# Altium project PCB_Project.PrjPcb
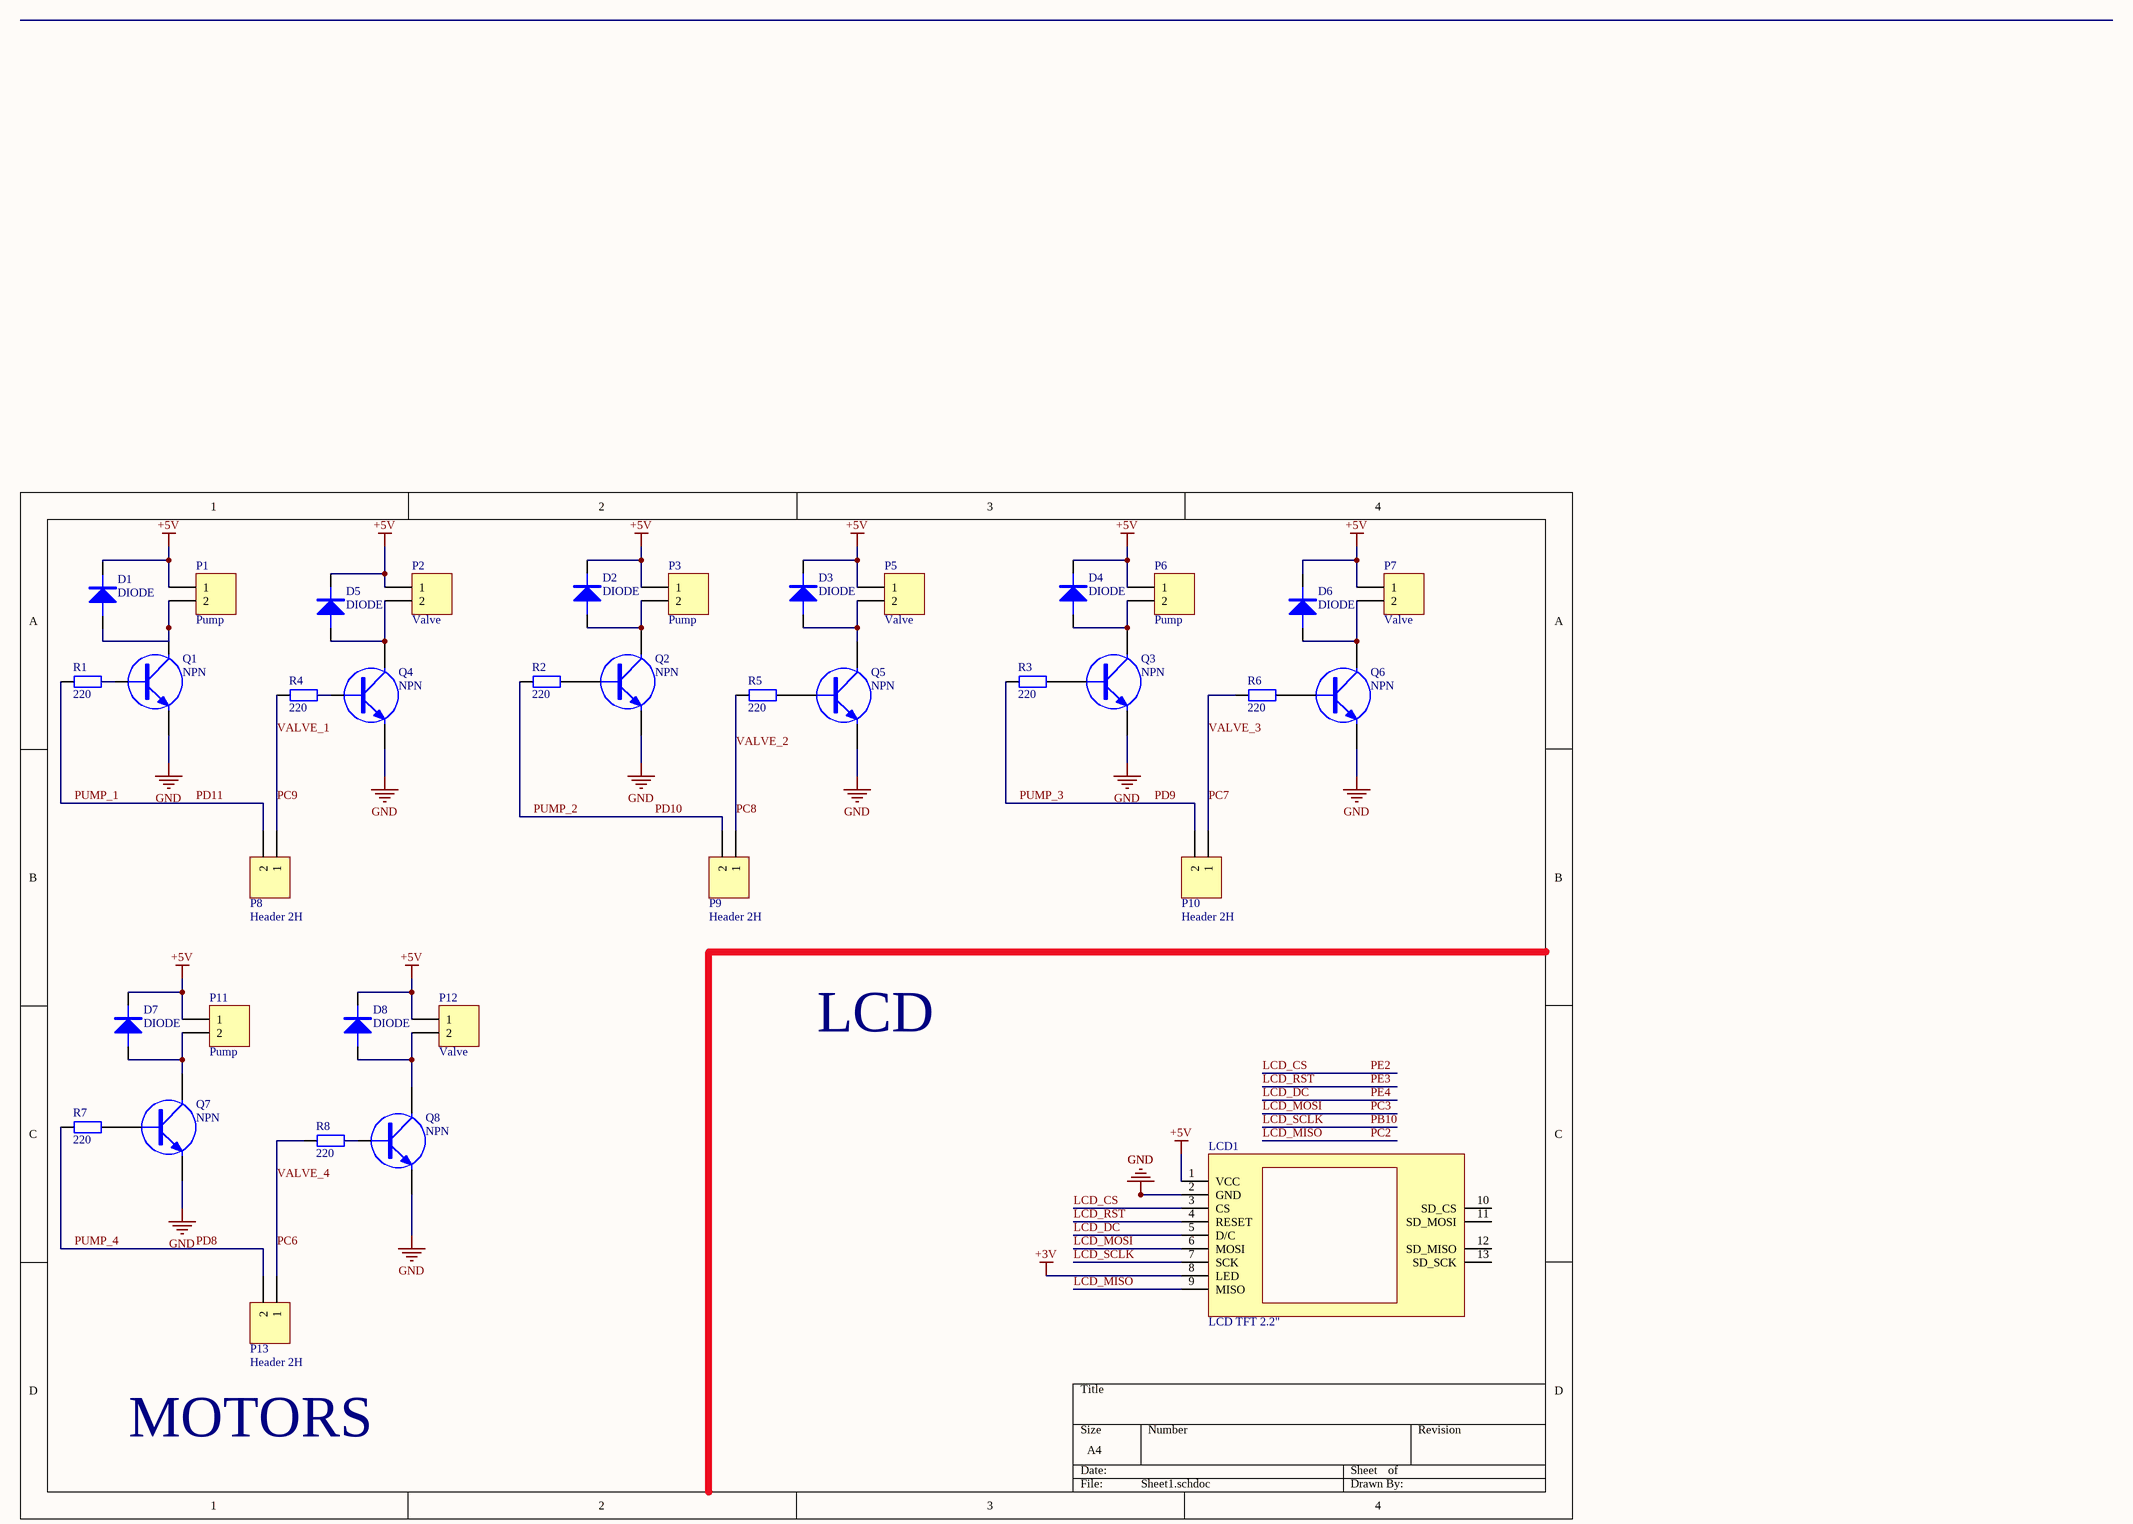
[diagram p0: Sheet1.schdoc]
3 sheets, 216 parts. Net scope: global (net labels, ports and power ports of the same name join across sheets).
Board files: PCB1.PcbDoc, PCB2.PcbDoc
Sheets:
  Sheet1.schdoc
  Sheet2.SchDoc
  Sheet3.SchDoc

## Sheet Sheet1.schdoc
size A4

### Parts
D1  DIODE  [DIODE SMA]
D2  DIODE  [DIODE SMA]
D3  DIODE  [DIODE SMA]
D4  DIODE  [DIODE SMA]
D5  DIODE  [DIODE SMA]
D6  DIODE  [DIODE SMA]
D7  DIODE  [DIODE SMA]
D8  DIODE  [DIODE SMA]
LCD1  LCD TFT 2.2"  [LCD TFT 2.2"]
P1  Pump  [HDR1X2]
P2  Valve  [HDR1X2]
P3  Pump  [HDR1X2]
P5  Valve  [HDR1X2]
P6  Pump  [HDR1X2]
P7  Valve  [HDR1X2]
P8  Header 2H  [HDR1X2]
P9  Header 2H  [HDR1X2]
P10  Header 2H  [HDR1X2]
P11  Pump  [HDR1X2]
P12  Valve  [HDR1X2]
P13  Header 2H  [HDR1X2]
Q1  NPN  [SOT23 - 3PIN]
Q2  NPN  [SOT23 - 3PIN]
Q3  NPN  [SOT23 - 3PIN]
Q4  NPN  [SOT23 - 3PIN]
Q5  NPN  [SOT23 - 3PIN]
Q6  NPN  [SOT23 - 3PIN]
Q7  NPN  [SOT23 - 3PIN]
Q8  NPN  [SOT23 - 3PIN]
R1  220  [0805 RESISTOR]
R2  220  [0805 RESISTOR]
R3  220  [0805 RESISTOR]
R4  220  [0805 RESISTOR]
R5  220  [0805 RESISTOR]
R6  220  [0805 RESISTOR]
R7  220  [0805 RESISTOR]
R8  220  [0805 RESISTOR]

### Nets
+3V: LCD1.8(LED)
+5V: D1.2 D2.2 D3.2 D4.2 D5.2 D6.2 D7.2 D8.2 LCD1.1(VCC) P1.1 P2.1 P3.1 P5.1 P6.1 P7.1 P11.1 P12.1
GND: LCD1.2(GND) Q1.1(E) Q2.1(E) Q3.1(E) Q4.1(E) Q5.1(E) Q6.1(E) Q7.1(E) Q8.1(E)
LCD_CS: LCD1.3(CS)  [also labelled PE2]
LCD_DC: LCD1.5(D/C)  [also labelled PE4]
LCD_MISO: LCD1.9(MISO)  [also labelled PC2]
LCD_MOSI: LCD1.6(MOSI)  [also labelled PC3]
LCD_RST: LCD1.4(RESET)  [also labelled PE3]
LCD_SCLK: LCD1.7(SCK)  [also labelled PB10]
PC6: P13.1 R8.2  [also labelled VALVE_4]
PC7: P10.1 R6.2  [also labelled VALVE_3]
PC8: P9.1 R5.2  [also labelled VALVE_2]
PC9: P8.1 R4.2  [also labelled VALVE_1]
PD8: P13.2 R7.2  [also labelled PUMP_4]
PD9: P10.2 R3.2  [also labelled PUMP_3]
PD10: P9.2 R2.2  [also labelled PUMP_2]
PD11: P8.2 R1.2  [also labelled PUMP_1]
NetD1_1: D1.1 P1.2 Q1.2(C)
NetD2_1: D2.1 P3.2 Q2.2(C)
NetD3_1: D3.1 P5.2 Q5.2(C)
NetD4_1: D4.1 P6.2 Q3.2(C)
NetD5_1: D5.1 P2.2 Q4.2(C)
NetD6_1: D6.1 P7.2 Q6.2(C)
NetD7_1: D7.1 P11.2 Q7.2(C)
NetD8_1: D8.1 P12.2 Q8.2(C)
NetQ1_3: Q1.3(B) R1.1
NetQ2_3: Q2.3(B) R2.1
NetQ3_3: Q3.3(B) R3.1
NetQ4_3: Q4.3(B) R4.1
NetQ5_3: Q5.3(B) R5.1
NetQ6_3: Q6.3(B) R6.1
NetQ7_3: Q7.3(B) R7.1
NetQ8_3: Q8.3(B) R8.1

Not connected (* = marked no-connect by the designer): LCD1 10(SD_CS) 11(SD_MOSI) 12(SD_MISO) 13(SD_SCK)

### Notes on the sheet
- LCD
- MOTORS

### Library data of the parts
P1-P3 P5-P7 P11 P12 = Header 2H: LatestRevisionDate: 17-Jul-2002; LatestRevisionNote: Re-released for DXP Platform.; Publisher: Altium Limited
R1-R8 = RESISTOR: Value: R1/4W - 1K
P8-P10 P13 = Header 2H: LatestRevisionDate: 17-Jul-2002; LatestRevisionNote: Re-released for DXP Platform.; Publisher: Altium Limited

## Sheet Sheet2.SchDoc
size A3
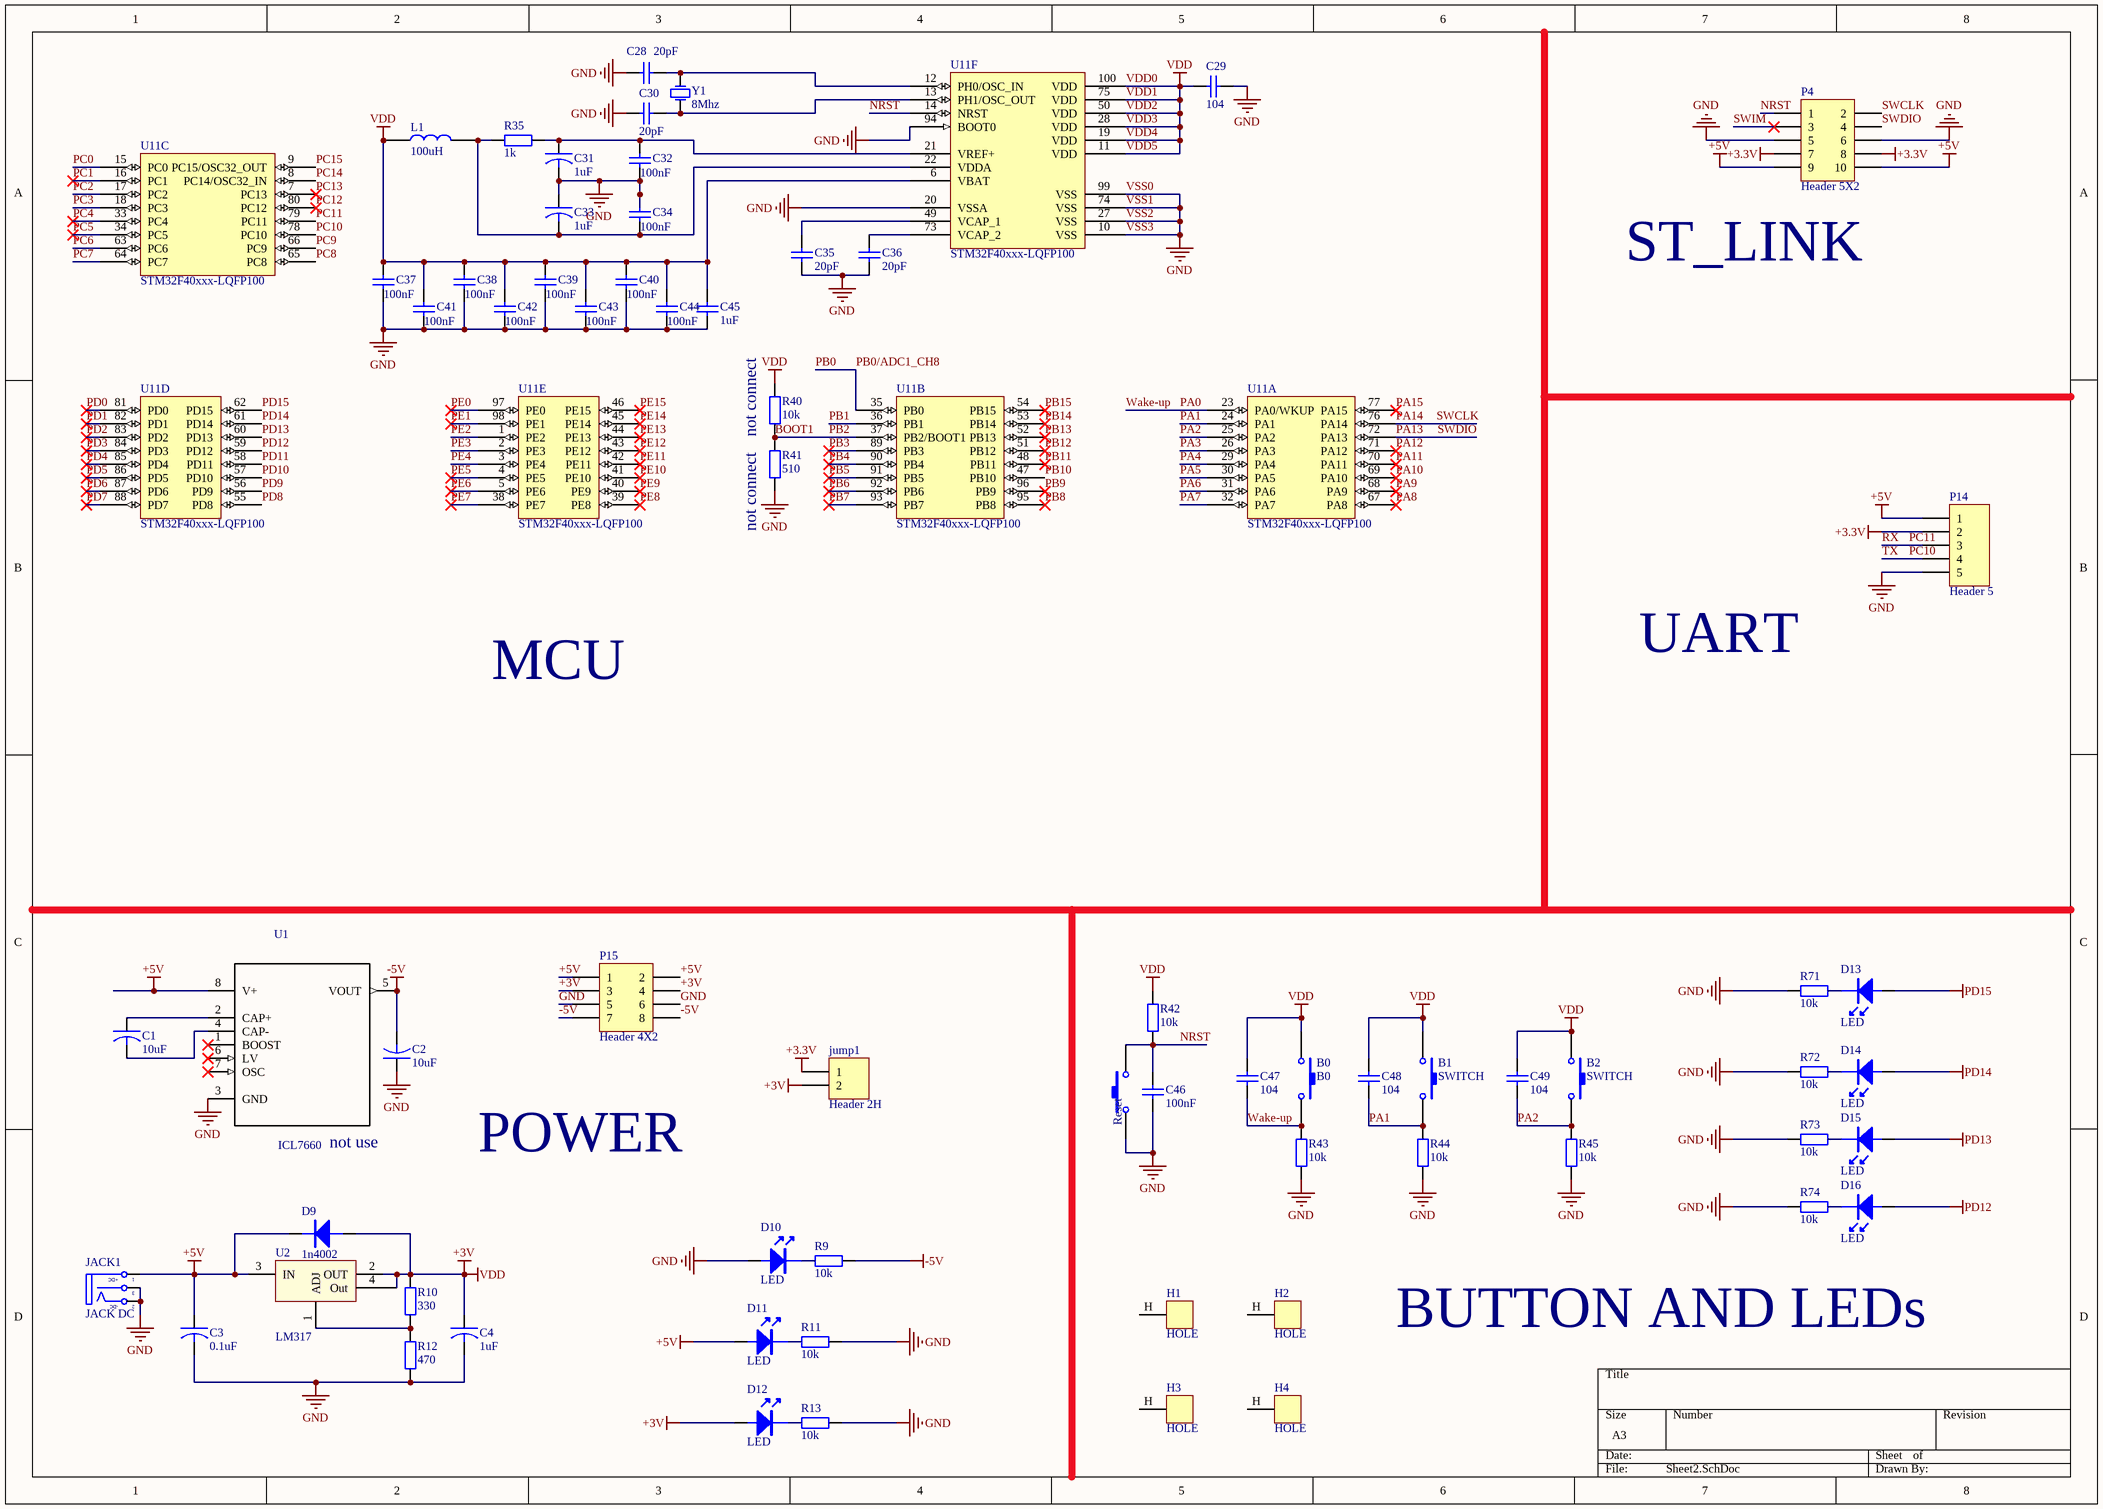
[diagram p1: Sheet2.SchDoc]

### Parts
B0  B0  [SW 4PIN]
B1  SWITCH  [SW 4PIN]
B2  SWITCH  [SW 4PIN]
C1  10uF  [3.5X2.8X1.9]
C2  10uF  [3.5X2.8X1.9]
C3  0.1uF  [3.5X2.8X1.9]
C4  1uF  [3.5X2.8X1.9]
C28  20pF  [0805 CAP]
C29  104  [0805 CAP]
C30  20pF  [0805 CAP]
C31  1uF  [3.5X2.8X1.9]
C32  100nF  [0805 CAP]
C33  1uF  [3.5X2.8X1.9]
C34  100nF  [0805 CAP]
C35  20pF  [0805 CAP]
C36  20pF  [0805 CAP]
C37  100nF  [0805 CAP]
C38  100nF  [0805 CAP]
C39  100nF  [0805 CAP]
C40  100nF  [0805 CAP]
C41  100nF  [0805 CAP]
C42  100nF  [0805 CAP]
C43  100nF  [0805 CAP]
C44  100nF  [0805 CAP]
C45  1uF  [0805 CAP]
C46  100nF  [0805 CAP]
C47  104  [0805 CAP]
C48  104  [0805 CAP]
C49  104  [0805 CAP]
D9  1n4002  [DIODE SMA]
D10  LED  [LED SMD 0805]
D11  LED  [LED SMD 0805]
D12  LED  [LED SMD 0805]
D13  LED  [LED SMD 0805]
D14  LED  [LED SMD 0805]
D15  LED  [LED SMD 0805]
D16  LED  [LED SMD 0805]
H1  HOLE  [HOLE]
H2  HOLE  [HOLE]
H3  HOLE  [HOLE]
H4  HOLE  [HOLE]
JACK1  JACK DC  [JACK DC]
jump1  Header 2H  [HDR1X2]
L1  100uH  [1206 Negro]
P4  Header 5X2  [HDR2X5 2mm]
P14  Header 5  [HDR1X5]
P15  Header 4X2  [HDR2X4]
R9  10k  [0805 RESISTOR]
R10  330  [0805 RESISTOR]
R11  10k  [0805 RESISTOR]
R12  470  [0805 RESISTOR]
R13  10k  [0805 RESISTOR]
R35  1k  [0805 RESISTOR]
R40  10k  [0805 RESISTOR]
R41  510  [0805 RESISTOR]
R42  10k  [0805 RESISTOR]
R43  10k  [0805 RESISTOR]
R44  10k  [0805 RESISTOR]
R45  10k  [0805 RESISTOR]
R71  10k  [0805 RESISTOR]
R72  10k  [0805 RESISTOR]
R73  10k  [0805 RESISTOR]
R74  10k  [0805 RESISTOR]
Reset  (no value)  [SW 4PIN]
U1  ICL7660  [SOIC 8PIN]
U2  LM317  [SOT223-4N]
U11  STM32F40xxx-LQFP100  [LQFP 100PIN]  (parts A,B,C,D,E,F of 6)
Y1  8Mhz  [CRYSTAL DIP]

### Nets
+3.3V: jump1.1 P4.7 P4.8 P14.2
+3V: B0.1 B1.1 B2.1 C4.1 C29.1 C37.2 C38.2 C39.2 C40.2 C41.2 C42.2 C43.2 C44.2 C45.2 C47.2 C48.2 C49.2 D9.1 D12.1 jump1.2 L1.1 P15.3 P15.4 R10.1 R40.2 R42.1 U2.2(OUT) U2.4(Out) U11.6(VBAT) U11.11(VDD) U11.19(VDD) U11.28(VDD) U11.50(VDD) U11.75(VDD) U11.100(VDD)  [also labelled VDD, VDD0, VDD1, VDD2, VDD3, VDD4, VDD5]
+5V: C3.1 D9.2 D11.1 JACK1.1(T) P4.9 P4.10 P14.1 P15.1 P15.2 U1.8(V+) U2.3(IN)
-5V: C2.2 P15.7 P15.8 R9.2 U1.5(VOUT)
GND: C2.1 C3.2 C4.2 C28.1 C29.2 C30.1 C31.2 C32.1 C33.1 C34.2 C35.1 C36.1 C37.1 C38.1 C39.1 C40.1 C41.1 C42.1 C43.1 C44.1 C45.1 C46.2 D10.1 JACK1.2(TN) JACK1.3(S) P4.5 P4.6 P14.5 P15.5 P15.6 R11.2 R12.2 R13.2 R41.1 R43.1 R44.1 R45.1 R71.2 R72.2 R73.2 R74.2 Reset.1 U1.3(GND) U11.10(VSS) U11.20(VSSA) U11.27(VSS) U11.74(VSS) U11.94(BOOT0) U11.99(VSS)  [also labelled VSS0, VSS1, VSS2, VSS3]
PD12: D16.1 U11.59(PD12)
PD13: D15.1 U11.60(PD13)
PD14: D14.1 U11.61(PD14)
PD15: D13.1 U11.62(PD15)
BOOT1: R40.1 R41.2 U11.37(PB2/BOOT1)  [also labelled PB2]
NRST: C46.1 P4.1 R42.2 Reset.2 U11.14(NRST)
PA0: B0.2 C47.1 R43.2 U11.23(PA0/WKUP)  [also labelled Wake-up]
PA1: B1.2 C48.1 R44.2 U11.24(PA1)
PA2: B2.2 C49.1 R45.2 U11.25(PA2)
PA3: U11.26(PA3)
PA4: U11.29(PA4)
PA5: U11.30(PA5)
PA6: U11.31(PA6)
PA7: U11.32(PA7)
PA8: U11.67(PA8)
PA9: U11.68(PA9)
PA10: U11.69(PA10)
PA11: U11.70(PA11)
PA12: U11.71(PA12)
PA13: P4.4 U11.72(PA13)  [also labelled SWDIO]
PA14: P4.2 U11.76(PA14)  [also labelled SWCLK]
PA15: U11.77(PA15)
PB0: U11.35(PB0)  [also labelled PB0/ADC1_CH8]
PB1: U11.36(PB1)
PB3: U11.89(PB3)
PB4: U11.90(PB4)
PB5: U11.91(PB5)
PB6: U11.92(PB6)
PB7: U11.93(PB7)
PB8: U11.95(PB8)
PB9: U11.96(PB9)
PB10: U11.47(PB10)  [project net LCD_SCLK]
PB11: U11.48(PB11)
PB12: U11.51(PB12)
PB13: U11.52(PB13)
PB14: U11.53(PB14)
PB15: U11.54(PB15)
PC0: U11.15(PC0)
PC1: U11.16(PC1)
PC2: U11.17(PC2)  [project net LCD_MISO]
PC3: U11.18(PC3)  [project net LCD_MOSI]
PC4: U11.33(PC4)
PC5: U11.34(PC5)
PC6: U11.63(PC6)
PC7: U11.64(PC7)
PC8: U11.65(PC8)
PC9: U11.66(PC9)
PC10: P14.4 U11.78(PC10)  [also labelled TX]
PC11: P14.3 U11.79(PC11)  [also labelled RX]
PC12: U11.80(PC12)
PC13: U11.7(PC13)
PC14: U11.8(PC14/OSC32_IN)
PC15: U11.9(PC15/OSC32_OUT)
PD0: U11.81(PD0)
PD1: U11.82(PD1)
PD2: U11.83(PD2)
PD3: U11.84(PD3)
PD4: U11.85(PD4)
PD5: U11.86(PD5)
PD6: U11.87(PD6)
PD7: U11.88(PD7)
PD8: U11.55(PD8)
PD9: U11.56(PD9)
PD10: U11.57(PD10)
PD11: U11.58(PD11)
PE0: U11.97(PE0)
PE1: U11.98(PE1)
PE2: U11.1(PE2)  [project net LCD_CS]
PE3: U11.2(PE3)  [project net LCD_RST]
PE4: U11.3(PE4)  [project net LCD_DC]
PE5: U11.4(PE5)
PE6: U11.5(PE6)
PE7: U11.38(PE7)
PE8: U11.39(PE8)
PE9: U11.40(PE9)
PE10: U11.41(PE10)
PE11: U11.42(PE11)
PE12: U11.43(PE12)
PE13: U11.44(PE13)
PE14: U11.45(PE14)
PE15: U11.46(PE15)
SWIM: P4.3
NetC1_1: C1.1 U1.2(CAP+)
NetC1_2: C1.2 U1.4(CAP-)
NetC28_2: C28.2 U11.12(PH0/OSC_IN) Y1.2(OSC2)
NetC30_2: C30.2 U11.13(PH1/OSC_OUT) Y1.1(OSC1)
NetC31_1: C31.1 C32.2 R35.2 U11.21(VREF+)
NetC33_2: C33.2 C34.1 L1.2 R35.1 U11.22(VDDA)
NetC35_2: C35.2 U11.49(VCAP_1)
NetC36_2: C36.2 U11.73(VCAP_2)
NetD10_2: D10.2 R9.1
NetD11_2: D11.2 R11.1
NetD12_2: D12.2 R13.1
NetD13_2: D13.2 R71.1
NetD14_2: D14.2 R72.1
NetD15_2: D15.2 R73.1
NetD16_2: D16.2 R74.1
NetR10_2: R10.2 R12.1 U2.1(ADJ)

Not connected (* = marked no-connect by the designer): H1 H(HOLE); H2 H(HOLE); H3 H(HOLE); H4 H(HOLE); U1 1(BOOST)* 6(LV)* 7(OSC)*

### Notes on the sheet
- (near P4) ST_LINK
- not connect
- MCU
- UART
- (near U1) not use
- POWER
- BUTTON AND LEDs
- (in symbol JACK DC) +DC; -DC

### Library data of the parts
B0 Reset = SWITCH: Published: 24-Mar-1999; LatestRevisionDate: 17-Jul-2002; LatestRevisionNote: Re-released for DXP Platform.; PackageReference: SPST-2; Publisher: Altium Limited
C1-C4 C31 C33 = CAPACITOR
C28-C30 C32 C34-C49 = CAP CERAMIC: Published: 8-Jun-2000; LatestRevisionDate: 17-Jul-2002; LatestRevisionNote: Re-released for DXP Platform.; PackageReference: RAD-0.3; Publisher: Altium Limited
D9 = DIODE
JACK1 = JACK DC: Value: Jac DC
L1 = INDUCTOR
R9-R13 R35 R40-R45 R71-R74 = RESISTOR: Value: R1/4W - 1K
U1 = ICL7660SIBAZ: ICL7660 Series 1.5 - 12 Vin 45 mA 10-35 kHz CMOS Voltage Converter - SOIC-8; MF: Renesas Electronics; Availability: Unavailable; Package: SOIC-8 Intersil; Price: None; SnapEDA_Link: https://www.snapeda.com/parts/ICL7660SIBAZ/Renesas%20Electronics%20America%20Inc./view-part/?ref=snap; MP: ICL7660SIBAZ; Value: *
Y1 = Crystal: Published: 8-Jun-2000; LatestRevisionDate: 17-Jul-2002; LatestRevisionNote: Re-released for DXP Platform.; PackageReference: R38; Publisher: Altium Limited
B1 B2 = SWITCH: Published: 24-Mar-1999; LatestRevisionDate: 17-Jul-2002; LatestRevisionNote: Re-released for DXP Platform.; PackageReference: SPST-2; Publisher: Altium Limited
jump1 = Header 2H: LatestRevisionDate: 17-Jul-2002; LatestRevisionNote: Re-released for DXP Platform.; Publisher: Altium Limited
P4 = Header 5X2: LatestRevisionDate: 17-Jul-2002; LatestRevisionNote: Re-released for DXP Platform.; Publisher: Altium Limited
P14 = Header 5: LatestRevisionDate: 17-Jul-2002; LatestRevisionNote: Re-released for DXP Platform.; Publisher: Altium Limited
P15 = Header 4X2: LatestRevisionDate: 17-Jul-2002; LatestRevisionNote: Re-released for DXP Platform.; Publisher: Altium Limited
U2 = LM317: Value: LM317

## Sheet Sheet3.SchDoc
size A2
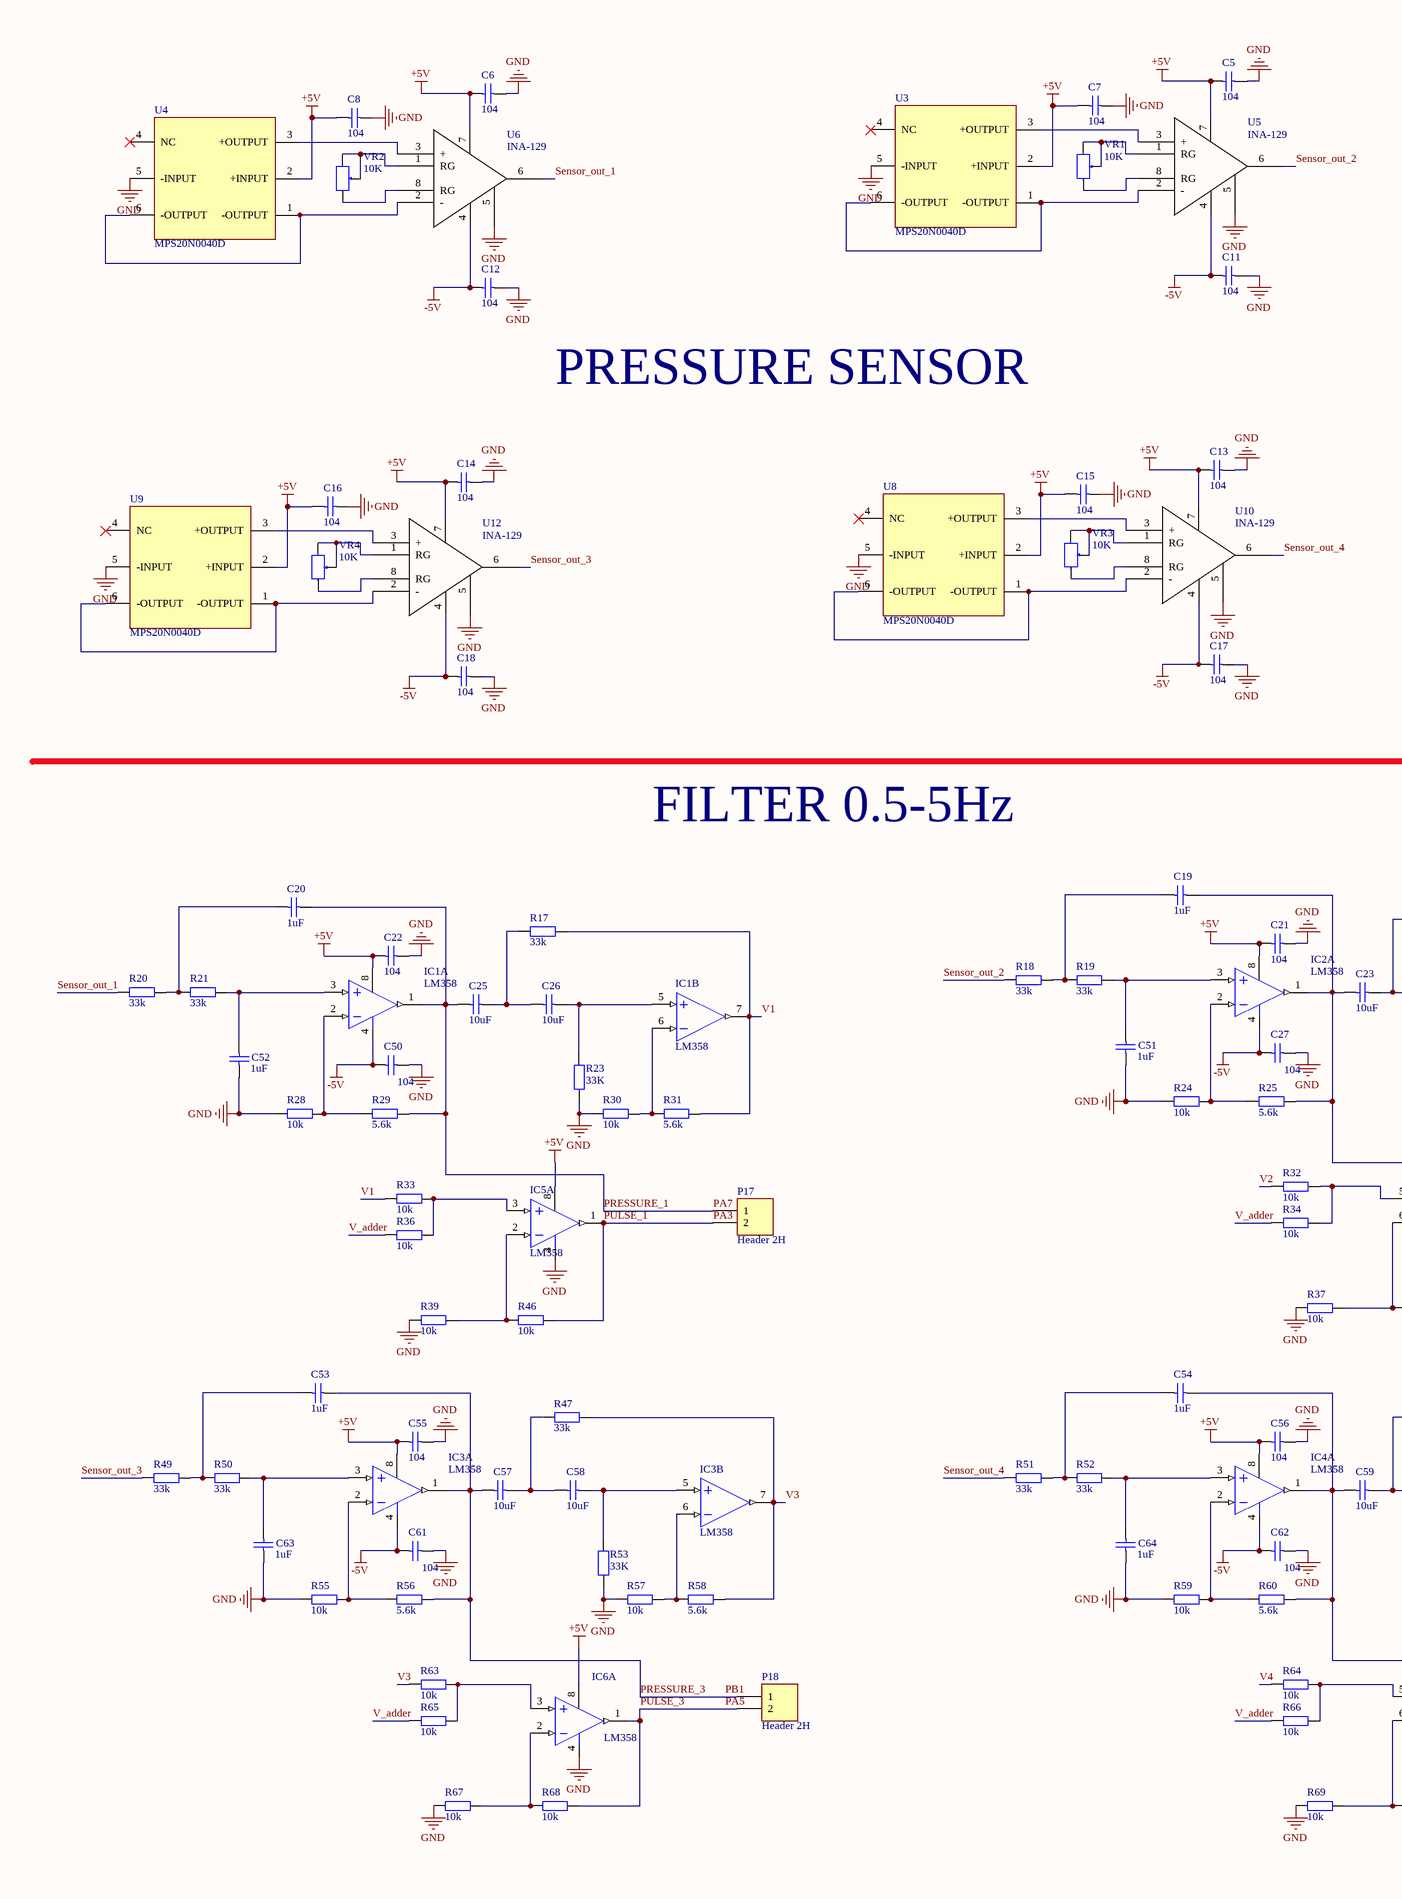
[diagram p2: Sheet3.SchDoc, left]
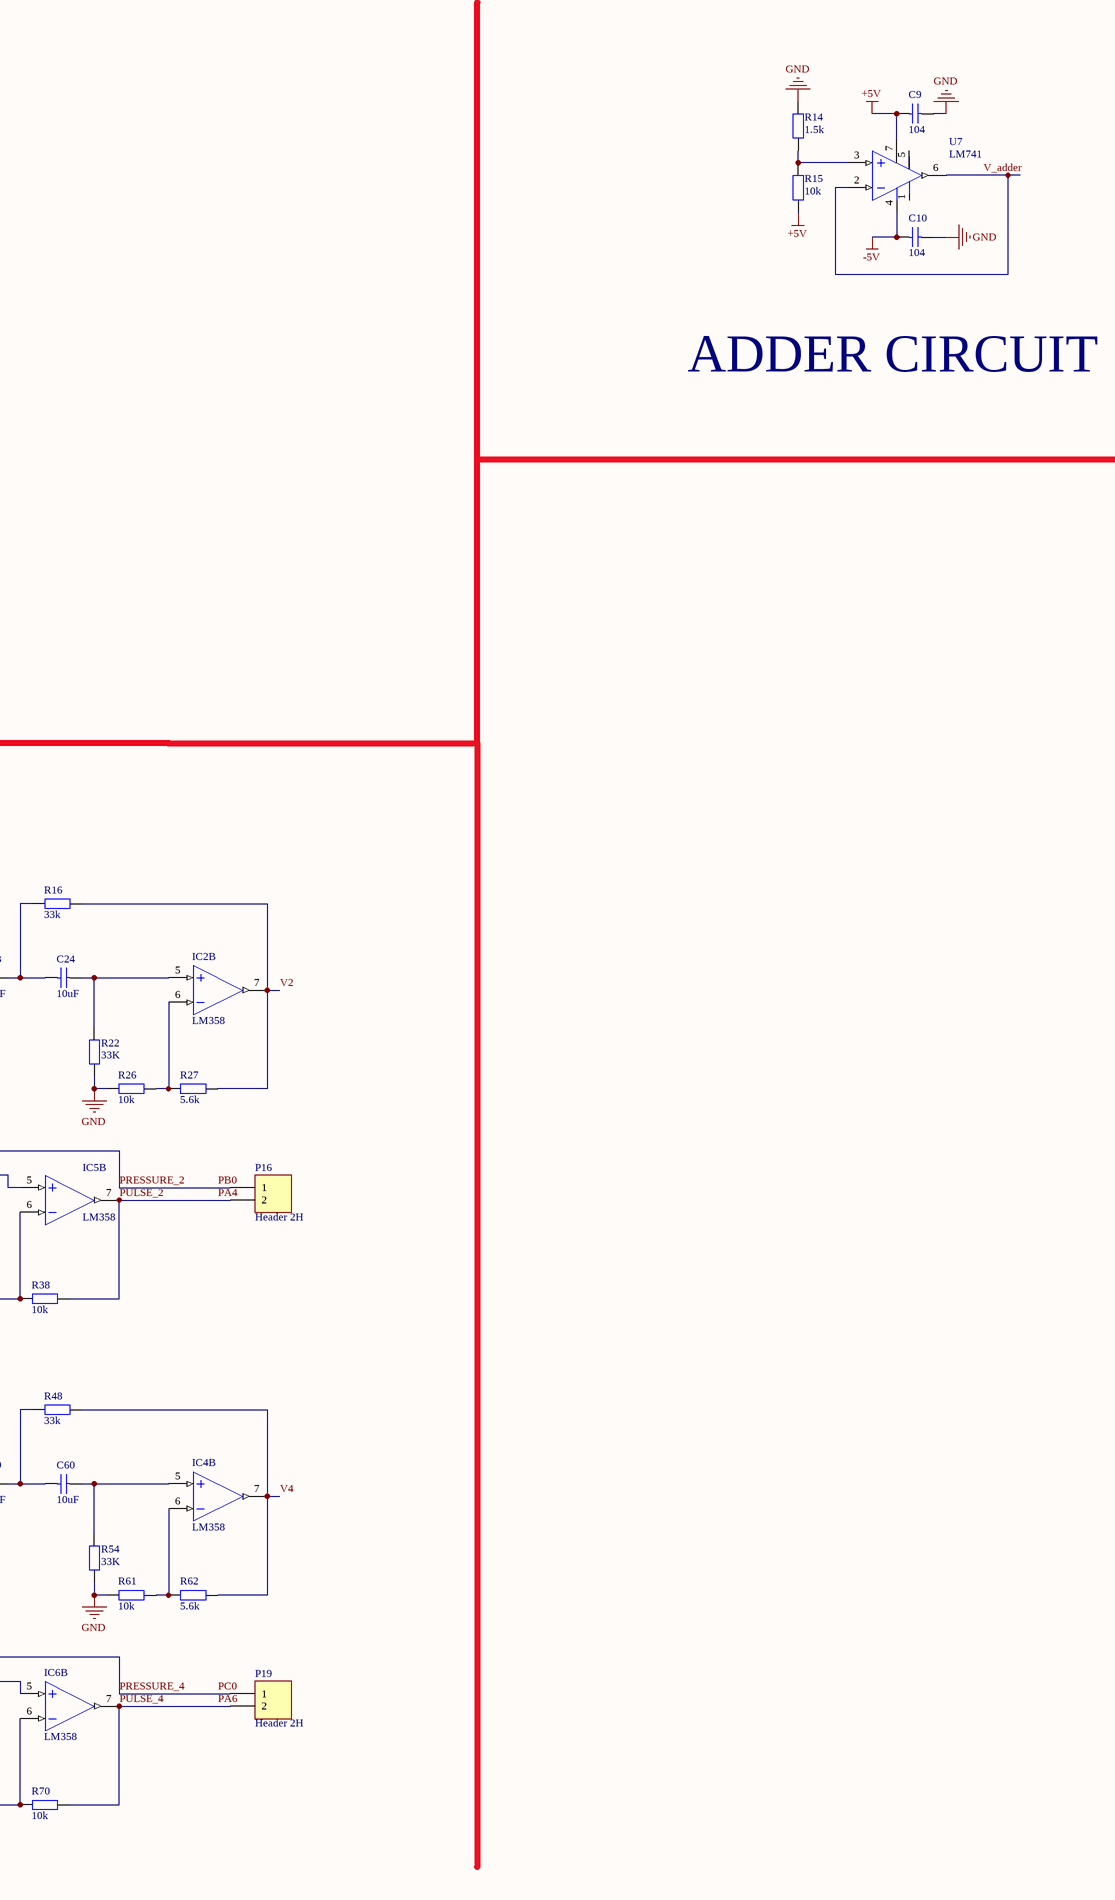
[diagram p3: Sheet3.SchDoc, right]

### Parts
C5  104  [0805 CAP]
C6  104  [0805 CAP]
C7  104  [0805 CAP]
C8  104  [0805 CAP]
C9  104  [0805 CAP]
C10  104  [0805 CAP]
C11  104  [0805 CAP]
C12  104  [0805 CAP]
C13  104  [0805 CAP]
C14  104  [0805 CAP]
C15  104  [0805 CAP]
C16  104  [0805 CAP]
C17  104  [0805 CAP]
C18  104  [0805 CAP]
C19  1uF  [0805 CAP]
C20  1uF  [0805 CAP]
C21  104  [0805 CAP]
C22  104  [0805 CAP]
C23  10uF  [0805 CAP]
C24  10uF  [0805 CAP]
C25  10uF  [0805 CAP]
C26  10uF  [0805 CAP]
C27  104  [0805 CAP]
C50  104  [0805 CAP]
C51  1uF  [0805 CAP]
C52  1uF  [0805 CAP]
C53  1uF  [0805 CAP]
C54  1uF  [0805 CAP]
C55  104  [0805 CAP]
C56  104  [0805 CAP]
C57  10uF  [0805 CAP]
C58  10uF  [0805 CAP]
C59  10uF  [0805 CAP]
C60  10uF  [0805 CAP]
C61  104  [0805 CAP]
C62  104  [0805 CAP]
C63  1uF  [0805 CAP]
C64  1uF  [0805 CAP]
IC1  LM358  [SOIC 8PIN]  (parts A,B of 2)
IC2  LM358  [SOIC 8PIN]  (parts A,B of 2)
IC3  LM358  [SOIC 8PIN]  (parts A,B of 2)
IC4  LM358  [SOIC 8PIN]  (parts A,B of 2)
IC5  LM358  [SOIC 8PIN]  (parts A,B of 2)
IC6  LM358  [SOIC 8PIN]  (parts A,B of 2)
P16  Header 2H  [HDR1X2]
P17  Header 2H  [HDR1X2]
P18  Header 2H  [HDR1X2]
P19  Header 2H  [HDR1X2]
R14  1.5k  [0805 RESISTOR]
R15  10k  [0805 RESISTOR]
R16  33k  [0805 RESISTOR]
R17  33k  [0805 RESISTOR]
R18  33k  [0805 RESISTOR]
R19  33k  [0805 RESISTOR]
R20  33k  [0805 RESISTOR]
R21  33k  [0805 RESISTOR]
R22  33K  [0805 RESISTOR]
R23  33K  [0805 RESISTOR]
R24  10k  [0805 RESISTOR]
R25  5.6k  [0805 RESISTOR]
R26  10k  [0805 RESISTOR]
R27  5.6k  [0805 RESISTOR]
R28  10k  [0805 RESISTOR]
R29  5.6k  [0805 RESISTOR]
R30  10k  [0805 RESISTOR]
R31  5.6k  [0805 RESISTOR]
R32  10k  [0805 RESISTOR]
R33  10k  [0805 RESISTOR]
R34  10k  [0805 RESISTOR]
R36  10k  [0805 RESISTOR]
R37  10k  [0805 RESISTOR]
R38  10k  [0805 RESISTOR]
R39  10k  [0805 RESISTOR]
R46  10k  [0805 RESISTOR]
R47  33k  [0805 RESISTOR]
R48  33k  [0805 RESISTOR]
R49  33k  [0805 RESISTOR]
R50  33k  [0805 RESISTOR]
R51  33k  [0805 RESISTOR]
R52  33k  [0805 RESISTOR]
R53  33K  [0805 RESISTOR]
R54  33K  [0805 RESISTOR]
R55  10k  [0805 RESISTOR]
R56  5.6k  [0805 RESISTOR]
R57  10k  [0805 RESISTOR]
R58  5.6k  [0805 RESISTOR]
R59  10k  [0805 RESISTOR]
R60  5.6k  [0805 RESISTOR]
R61  10k  [0805 RESISTOR]
R62  5.6k  [0805 RESISTOR]
R63  10k  [0805 RESISTOR]
R64  10k  [0805 RESISTOR]
R65  10k  [0805 RESISTOR]
R66  10k  [0805 RESISTOR]
R67  10k  [0805 RESISTOR]
R68  10k  [0805 RESISTOR]
R69  10k  [0805 RESISTOR]
R70  10k  [0805 RESISTOR]
U3  MPS20N0040D  [MPS20N0040D-S]
U4  MPS20N0040D  [MPS20N0040D-S]
U5  INA-129  [DIP 8]
U6  INA-129  [DIP 8]
U7  LM741  [SOIC 8PIN]
U8  MPS20N0040D  [MPS20N0040D-S]
U9  MPS20N0040D  [MPS20N0040D-S]
U10  INA-129  [DIP 8]
U12  INA-129  [DIP 8]
VR1  10K  [RVAR]
VR2  10K  [RVAR]
VR3  10K  [RVAR]
VR4  10K  [RVAR]

### Nets
+5V: C5.1 C6.1 C7.2 C8.2 C9.1 C13.1 C14.1 C15.2 C16.2 C21.1 C22.1 C55.1 C56.1 IC1.8(+V) IC2.8(+V) IC3.8(+V) IC4.8(+V) IC5.8(+V) IC6.8(+V) R15.2 U3.2(+INPUT) U4.2(+INPUT) U5.7 U6.7 U7.7(+V) U8.2(+INPUT) U9.2(+INPUT) U10.7 U12.7
-5V: C10.1 C11.2 C12.2 C17.2 C18.2 C27.1 C50.1 C61.1 C62.1 IC1.4(-V) IC2.4(-V) IC3.4(-V) IC4.4(-V) U5.4 U6.4 U7.4(-V) U10.4 U12.4
GND: C5.2 C6.2 C7.1 C8.1 C9.2 C10.2 C11.1 C12.1 C13.2 C14.2 C15.1 C16.1 C17.1 C18.1 C21.2 C22.2 C27.2 C50.2 C51.2 C52.2 C55.2 C56.2 C61.2 C62.2 C63.2 C64.2 IC5.4(-V) IC6.4(-V) R14.1 R22.1 R23.1 R24.1 R26.1 R28.1 R30.1 R37.1 R39.1 R53.1 R54.1 R55.1 R57.1 R59.1 R61.1 R67.1 R69.1 U3.5(-INPUT) U4.5(-INPUT) U5.5 U6.5 U8.5(-INPUT) U9.5(-INPUT) U10.5 U12.5
PA3: IC5.1(OUT) P17.2 R46.2  [also labelled PULSE_1]
PA4: IC5.7(OUT) P16.2 R38.2  [also labelled PULSE_2]
PA5: IC6.1(OUT) P18.2 R68.2  [also labelled PULSE_3]
PA6: IC6.7(OUT) P19.2 R70.2  [also labelled PULSE_4]
PA7: C20.2 C25.1 IC1.1(OUT) P17.1 R29.2  [also labelled PRESSURE_1]
PB0: C19.2 C23.1 IC2.1(OUT) P16.1 R25.2  [also labelled PRESSURE_2]
PB1: C53.2 C57.1 IC3.1(OUT) P18.1 R56.2  [also labelled PRESSURE_3]
PC0: C54.2 C59.1 IC4.1(OUT) P19.1 R60.2  [also labelled PRESSURE_4]
Sensor_out_1: R20.1 U6.6
Sensor_out_2: R18.1 U5.6
Sensor_out_3: R49.1 U12.6
Sensor_out_4: R51.1 U10.6
V1: IC1.7(OUT) R17.2 R31.2 R33.1
V2: IC2.7(OUT) R16.2 R27.2 R32.1
V3: IC3.7(OUT) R47.2 R58.2 R63.1
V4: IC4.7(OUT) R48.2 R62.2 R64.1
V_adder: R34.1 R36.1 R65.1 R66.1 U7.2(IN-) U7.6(OUT)
NetC19_1: C19.1 R18.2 R19.1
NetC20_1: C20.1 R20.2 R21.1
NetC23_2: C23.2 C24.1 R16.1
NetC24_2: C24.2 IC2.5(IN+) R22.2
NetC25_2: C25.2 C26.1 R17.1
NetC26_2: C26.2 IC1.5(IN+) R23.2
NetC51_1: C51.1 IC2.3(IN+) R19.2
NetC52_1: C52.1 IC1.3(IN+) R21.2
NetC53_1: C53.1 R49.2 R50.1
NetC54_1: C54.1 R51.2 R52.1
NetC57_2: C57.2 C58.1 R47.1
NetC58_2: C58.2 IC3.5(IN+) R53.2
NetC59_2: C59.2 C60.1 R48.1
NetC60_2: C60.2 IC4.5(IN+) R54.2
NetC63_1: C63.1 IC3.3(IN+) R50.2
NetC64_1: C64.1 IC4.3(IN+) R52.2
NetIC1_2: IC1.2(IN-) R28.2 R29.1
NetIC1_6: IC1.6(IN-) R30.2 R31.1
NetIC2_2: IC2.2(IN-) R24.2 R25.1
NetIC2_6: IC2.6(IN-) R26.2 R27.1
NetIC3_2: IC3.2(IN-) R55.2 R56.1
NetIC3_6: IC3.6(IN-) R57.2 R58.1
NetIC4_2: IC4.2(IN-) R59.2 R60.1
NetIC4_6: IC4.6(IN-) R61.2 R62.1
NetIC5_2: IC5.2(IN-) R39.2 R46.1
NetIC5_3: IC5.3(IN+) R33.2 R36.2
NetIC5_5: IC5.5(IN+) R32.2 R34.2
NetIC5_6: IC5.6(IN-) R37.2 R38.1
NetIC6_2: IC6.2(IN-) R67.2 R68.1
NetIC6_3: IC6.3(IN+) R63.2 R65.2
NetIC6_5: IC6.5(IN+) R64.2 R66.2
NetIC6_6: IC6.6(IN-) R69.2 R70.1
NetR14_2: R14.2 R15.1 U7.3(IN+)
NetU3_1: U3.1(-OUTPUT) U3.6(-OUTPUT) U5.2(-)
NetU3_3: U3.3(+OUTPUT) U5.3(+)
NetU4_1: U4.1(-OUTPUT) U4.6(-OUTPUT) U6.2(-)
NetU4_3: U4.3(+OUTPUT) U6.3(+)
NetU5_1: U5.1(RG) VR1.1 VR1.2
NetU5_8: U5.8(RG) VR1.3
NetU6_1: U6.1(RG) VR2.1 VR2.2
NetU6_8: U6.8(RG) VR2.3
NetU8_1: U8.1(-OUTPUT) U8.6(-OUTPUT) U10.2(-)
NetU8_3: U8.3(+OUTPUT) U10.3(+)
NetU9_1: U9.1(-OUTPUT) U9.6(-OUTPUT) U12.2(-)
NetU9_3: U9.3(+OUTPUT) U12.3(+)
NetU10_1: U10.1(RG) VR3.1 VR3.2
NetU10_8: U10.8(RG) VR3.3
NetU12_1: U12.1(RG) VR4.1 VR4.2
NetU12_8: U12.8(RG) VR4.3

Not connected (* = marked no-connect by the designer): U3 4(NC)*; U4 4(NC)*; U7 1(Vos) 5(Vos); U8 4(NC)*; U9 4(NC)*

### Notes on the sheet
- PRESSURE SENSOR
- ADDER CIRCUIT
- FILTER 0.5-5Hz

### Library data of the parts
C5-C27 C50-C64 = CAP CERAMIC: Published: 8-Jun-2000; LatestRevisionDate: 17-Jul-2002; LatestRevisionNote: Re-released for DXP Platform.; PackageReference: RAD-0.3; Publisher: Altium Limited
IC1-IC6 = LM358: Low-Power Dual Operational Amplifier; Value: LM358
R14-R34 R36-R39 R46-R70 = RESISTOR: Value: R1/4W - 1K
VR1-VR4 = VAR RES: Value: VR 10K
P16-P19 = Header 2H: LatestRevisionDate: 17-Jul-2002; LatestRevisionNote: Re-released for DXP Platform.; Publisher: Altium Limited

## Nets that join several sheets
+3V: Sheet1 (LCD1.8), Sheet2 (35 pins)
+5V: Sheet1 (17 pins), Sheet2 (11 pins), Sheet3 (29 pins)
-5V: Sheet2 (5 pins), Sheet3 (18 pins)
GND: Sheet1 (9 pins), Sheet2 (49 pins), Sheet3 (53 pins)
LCD_CS: Sheet1 (LCD1.3), Sheet2 (U11.1)
LCD_DC: Sheet1 (LCD1.5), Sheet2 (U11.3)
LCD_MISO: Sheet1 (LCD1.9), Sheet2 (U11.17)
LCD_MOSI: Sheet1 (LCD1.6), Sheet2 (U11.18)
LCD_RST: Sheet1 (LCD1.4), Sheet2 (U11.2)
LCD_SCLK: Sheet1 (LCD1.7), Sheet2 (U11.47)
PA3: Sheet2 (U11.26), Sheet3 (IC5.1 P17.2 R46.2)
PA4: Sheet2 (U11.29), Sheet3 (IC5.7 P16.2 R38.2)
PA5: Sheet2 (U11.30), Sheet3 (IC6.1 P18.2 R68.2)
PA6: Sheet2 (U11.31), Sheet3 (IC6.7 P19.2 R70.2)
PA7: Sheet2 (U11.32), Sheet3 (5 pins)
PB0: Sheet2 (U11.35), Sheet3 (5 pins)
PB1: Sheet2 (U11.36), Sheet3 (5 pins)
PC0: Sheet2 (U11.15), Sheet3 (5 pins)
PC6: Sheet1 (P13.1 R8.2), Sheet2 (U11.63)
PC7: Sheet1 (P10.1 R6.2), Sheet2 (U11.64)
PC8: Sheet1 (P9.1 R5.2), Sheet2 (U11.65)
PC9: Sheet1 (P8.1 R4.2), Sheet2 (U11.66)
PD8: Sheet1 (P13.2 R7.2), Sheet2 (U11.55)
PD9: Sheet1 (P10.2 R3.2), Sheet2 (U11.56)
PD10: Sheet1 (P9.2 R2.2), Sheet2 (U11.57)
PD11: Sheet1 (P8.2 R1.2), Sheet2 (U11.58)